# EAGLE design PCB_MOTEUR_V0_1b (EAGLE 9.2.2)
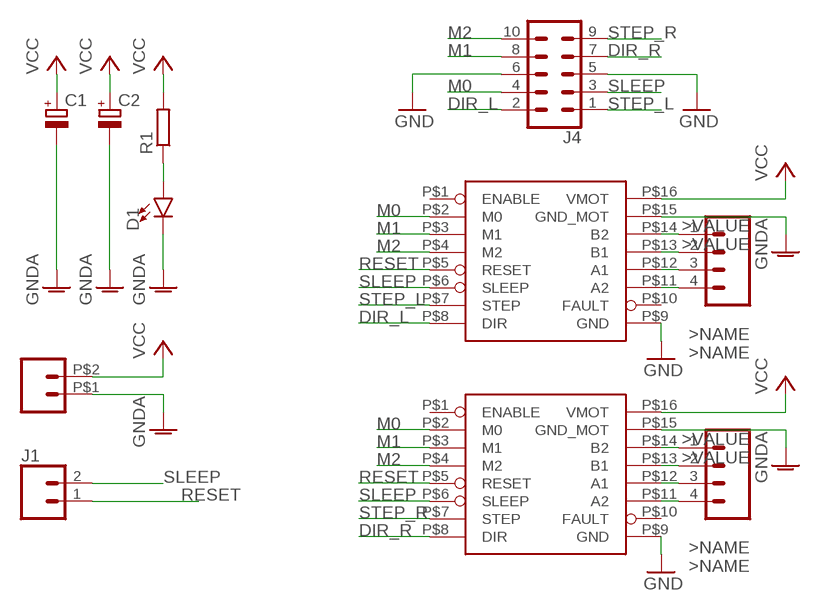
[diagram p0: schematic, sheet 1]

## Parts
C1  CPOL-EUE3.5-8  [E3,5-8]
C2  CPOL-EUE3.5-8  [E3,5-8]
D1  LED3MM  [LED_3MM]
J1  CONN_02  [1X02]
J2  CONN_027A-C  [NSK396-2C]
J3  CONN_04POLAR  [MOLEX-1X4]
J4  CONN_05X2SHD  [2X5-SHROUDED]
J5  CONN_04POLAR  [MOLEX-1X4]
R1  R-EU_0207/2V  [0207/2V]
U$1  DRV8825  [DRIVER_CARRIER_POLOLU_16]
U$2  DRV8825  [DRIVER_CARRIER_POLOLU_16]

## Nets
DIR_L: J4.2 U$1.P$8(DIR)
DIR_R: J4.7 U$2.P$8(DIR)
GND: J4.5 J4.6 U$1.P$9(GND) U$2.P$9(GND)
GNDA: C1.- C2.- D1.K(C) J2.P$1 U$1.P$15(GND_MOT) U$2.P$15(GND_MOT)
M0: J4.4 U$1.P$2(M0) U$2.P$2(M0)
M1: J4.8 U$1.P$3(M1) U$2.P$3(M1)
M2: J4.10 U$1.P$4(M2) U$2.P$4(M2)
N$1: J3.1 U$1.P$14(B2)
N$2: J3.2 U$1.P$13(B1)
N$3: J3.3 U$1.P$12(A1)
N$4: J3.4 U$1.P$11(A2)
N$5: D1.A R1.1
N$7: J5.1 U$2.P$14(B2)
N$8: J5.2 U$2.P$13(B1)
N$9: J5.3 U$2.P$12(A1)
N$14: J5.4 U$2.P$11(A2)
RESET: J1.1 U$1.P$5(RESET) U$2.P$5(RESET)
SLEEP: J1.2 J4.3 U$1.P$6(SLEEP) U$2.P$6(SLEEP)
STEP_L: J4.1 U$1.P$7(STEP)
STEP_R: J4.9 U$2.P$7(STEP)
VCC: C1.+ C2.+ J2.P$2 R1.2 U$1.P$16(VMOT) U$2.P$16(VMOT)
Unconnected: U$1.P$1(ENABLE) U$1.P$10(FAULT) U$2.P$1(ENABLE) U$2.P$10(FAULT)

## Library data of the parts
C1 C2 = rcl:CPOL-EU: POLARIZED CAPACITOR, European symbol; SPICEPREFIX: C
D1 = OPENBOT:LED: LED (Generic) Standard schematic elements and footprints for 5mm, 3mm, 1206, and 0603 sized LEDs. Generic LEDs with no color specified.; PROD_ID: DIO-08794
J1 J2 = OPENBOT:CONN_02: Multi connection point. Often used as Generic Header-pin footprint for 0.1 inch spaced/style header connections On any of the 0.1 inch spaced packages, you can populate with these: Break Away Headers - Straight <https://www.sparkfun.com/products/116> (PRT-00116) Break Away Male Headers - Right Angle <https://www.sparkfun.com/products/553> (PRT-00553) Female Headers <https://www.sparkfun.com/products/115> (PRT-00115) Break Away Headers - Machine Pin <https://www.sparkfun.com/products/117> (PRT-00117) Break Away Female Headers - Swiss Machine Pin <https://www.sparkfun.com/products/743> (PRT-00743) For SCREWTERMINALS and SPRING TERMINALS visit here: Screw Terimnals on SparkFun.com <https://www.sparkfun.com/search/results?term=Screw+Terminals> (5mm/3.5mm/2.54mm spacing) This device is also useful as a general connection point to wire up your design to another part of your project. Our various solder wires solder well into these plated through hole pads. Hook-Up Wire - Assortment (Stranded, 22 AWG) <https://www.sparkfun.com/products/11375> (PRT-11375) Hook-Up Wire - Assortment (Solid Core, 22 AWG) <https://www.sparkfun.com/products/11367> (PRT-11367) View the entire wire category on our website here <https://www.sparkfun.com/categories/141> Special notes: Molex polarized connector foot print use with: PRT-08233 with associated crimp pins and housings. 2.54_SCREWTERM for use with PRT-10571. 3.5mm Screw Terminal footprints for PRT-08084 5mm Screw Terminal footprints for use with PRT-08432 Multi connection point. Often used as Generic Header-pin footprint for 0.1 inch spaced/style header connections On any of the 0.1 inch spaced packages, you can populate with these: Break Away Headers - Straight <https://www.sparkfun.com/products/116> (PRT-00116) Break Away Male Headers - Right Angle <https://www.sparkfun.com/products/553> (PRT-00553) Female Headers <https://www.sparkfun.com/products/115> (PRT-00115) Break Away Headers - Machine Pin <https://www.sparkfun.com/products/117> (PRT-00117) Break Away Female Headers - Swiss Machine Pin <https://www.sparkfun.com/products/743> (PRT-00743) For SCREWTERMINALS and SPRING TERMINALS visit here: Screw Terimnals on SparkFun.com <https://www.sparkfun.com/search/results?term=Screw+Terminals> (5mm/3.5mm/2.54mm spacing) This device is also useful as a general connection point to wire up your design to another part of your project. Our various solder wires solder well into these plated through hole pads. Hook-Up Wire - Assortment (Stranded, 22 AWG) <https://www.sparkfun.com/products/11375> (PRT-11375) Hook-Up Wire - Assortment (Solid Core, 22 AWG) <https://www.sparkfun.com/products/11367> (PRT-11367) View the entire wire category on our website here <https://www.sparkfun.com/categories/141> Special notes: Molex polarized connector foot print use with: PRT-08233 with associated crimp pins and housings. 2.54_SCREWTERM for use with PRT-10571. 3.5mm Screw Terminal footprints for PRT-08084 5mm Screw Terminal footprints for use with PRT-08432
J3 J5 = OPENBOT:CONN_04: Multi connection point. Often used as Generic Header-pin footprint for 0.1 inch spaced/style header connections On any of the 0.1 inch spaced packages, you can populate with these: Break Away Headers - Straight <https://www.sparkfun.com/products/116> (PRT-00116) Break Away Male Headers - Right Angle <https://www.sparkfun.com/products/553> (PRT-00553) Female Headers <https://www.sparkfun.com/products/115> (PRT-00115) Break Away Headers - Machine Pin <https://www.sparkfun.com/products/117> (PRT-00117) Break Away Female Headers - Swiss Machine Pin <https://www.sparkfun.com/products/743> (PRT-00743) For SCREWTERMINALS and SPRING TERMINALS visit here: Screw Terimnals on SparkFun.com <https://www.sparkfun.com/search/results?term=Screw+Terminals> (5mm/3.5mm/2.54mm spacing) This device is also useful as a general connection point to wire up your design to another part of your project. Our various solder wires solder well into these plated through hole pads. Hook-Up Wire - Assortment (Stranded, 22 AWG) <https://www.sparkfun.com/products/11375> (PRT-11375) Hook-Up Wire - Assortment (Solid Core, 22 AWG) <https://www.sparkfun.com/products/11367> (PRT-11367) View the entire wire category on our website here <https://www.sparkfun.com/categories/141> Special notes: Molex polarized connector foot print use with SKU : PRT-08231 with associated crimp pins and housings. 1MM SMD Version SKU: PRT-10208 Multi connection point. Often used as Generic Header-pin footprint for 0.1 inch spaced/style header connections On any of the 0.1 inch spaced packages, you can populate with these: Break Away Headers - Straight <https://www.sparkfun.com/products/116> (PRT-00116) Break Away Male Headers - Right Angle <https://www.sparkfun.com/products/553> (PRT-00553) Female Headers <https://www.sparkfun.com/products/115> (PRT-00115) Break Away Headers - Machine Pin <https://www.sparkfun.com/products/117> (PRT-00117) Break Away Female Headers - Swiss Machine Pin <https://www.sparkfun.com/products/743> (PRT-00743) For SCREWTERMINALS and SPRING TERMINALS visit here: Screw Terimnals on SparkFun.com <https://www.sparkfun.com/search/results?term=Screw+Terminals> (5mm/3.5mm/2.54mm spacing) This device is also useful as a general connection point to wire up your design to another part of your project. Our various solder wires solder well into these plated through hole pads. Hook-Up Wire - Assortment (Stranded, 22 AWG) <https://www.sparkfun.com/products/11375> (PRT-11375) Hook-Up Wire - Assortment (Solid Core, 22 AWG) <https://www.sparkfun.com/products/11367> (PRT-11367) View the entire wire category on our website here <https://www.sparkfun.com/categories/141> Special notes: Molex polarized connector foot print use with SKU : PRT-08231 with associated crimp pins and housings. 1MM SMD Version SKU: PRT-10208; PROD_ID: CONN-08186; SF_ID: PRT-08231
J4 = OPENBOT:CONN_05X2: Multi connection point. Often used as Generic Header-pin footprint for 0.1 inch spaced/style header connections For AVR SPI programming port, see special device with nice symbol: "AVR_SPI_PROG_5x2.dev" You can populate with any combo of single row headers, but if you'd like an exact match, check these: 2x5 AVR ICSP Male Header <https://www.sparkfun.com/products/778> (PRT-00778) 2x5 Pin Shrouded Header <https://www.sparkfun.com/products/8506> (PRT-08506) On any of the 0.1 inch spaced packages, you can populate with these: Break Away Headers - Straight <https://www.sparkfun.com/products/116> (PRT-00116) Break Away Male Headers - Right Angle <https://www.sparkfun.com/products/553> (PRT-00553) Female Headers <https://www.sparkfun.com/products/115> (PRT-00115) Break Away Headers - Machine Pin <https://www.sparkfun.com/products/117> (PRT-00117) Break Away Female Headers - Swiss Machine Pin <https://www.sparkfun.com/products/743> (PRT-00743) Special note: the shrouded connector mates well with our 5x2 ribbon cables: 2x5 Pin IDC Ribbon Cable <https://www.sparkfun.com/products/8535> (PRT-08535); PROD_ID: CONN-08671; SF_ID: PRT-08506
R1 = rcl:R-EU_: RESISTOR, European symbol; SPICEPREFIX: R
U$1 U$2 = KARIBOUS:DRV8825

## Board
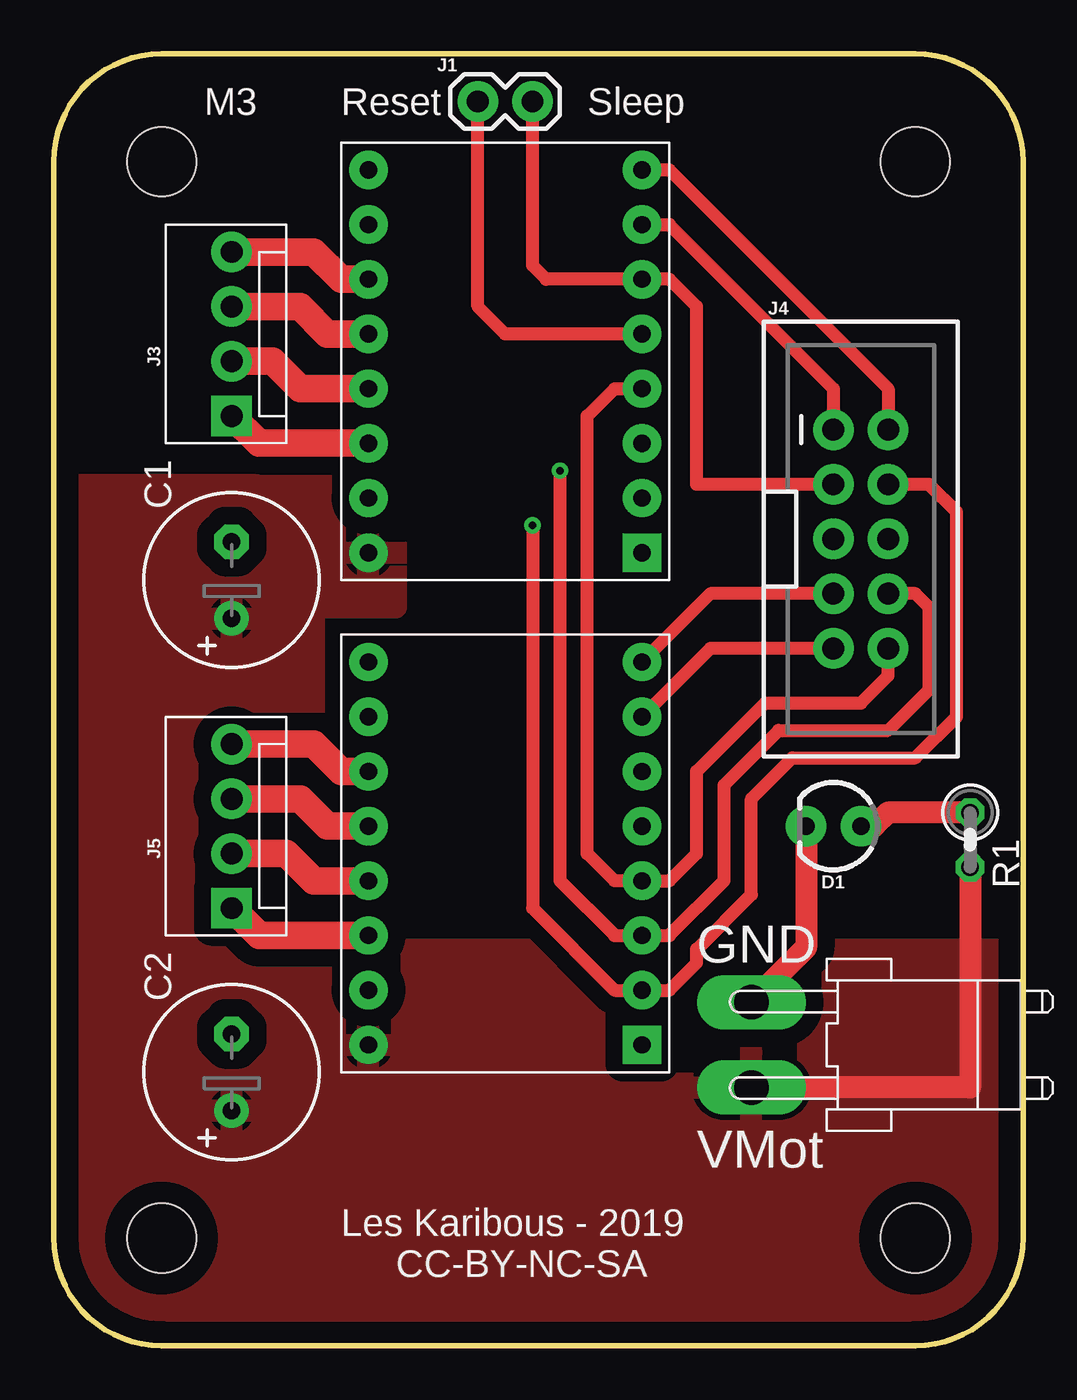
[diagram p1: board, top side]
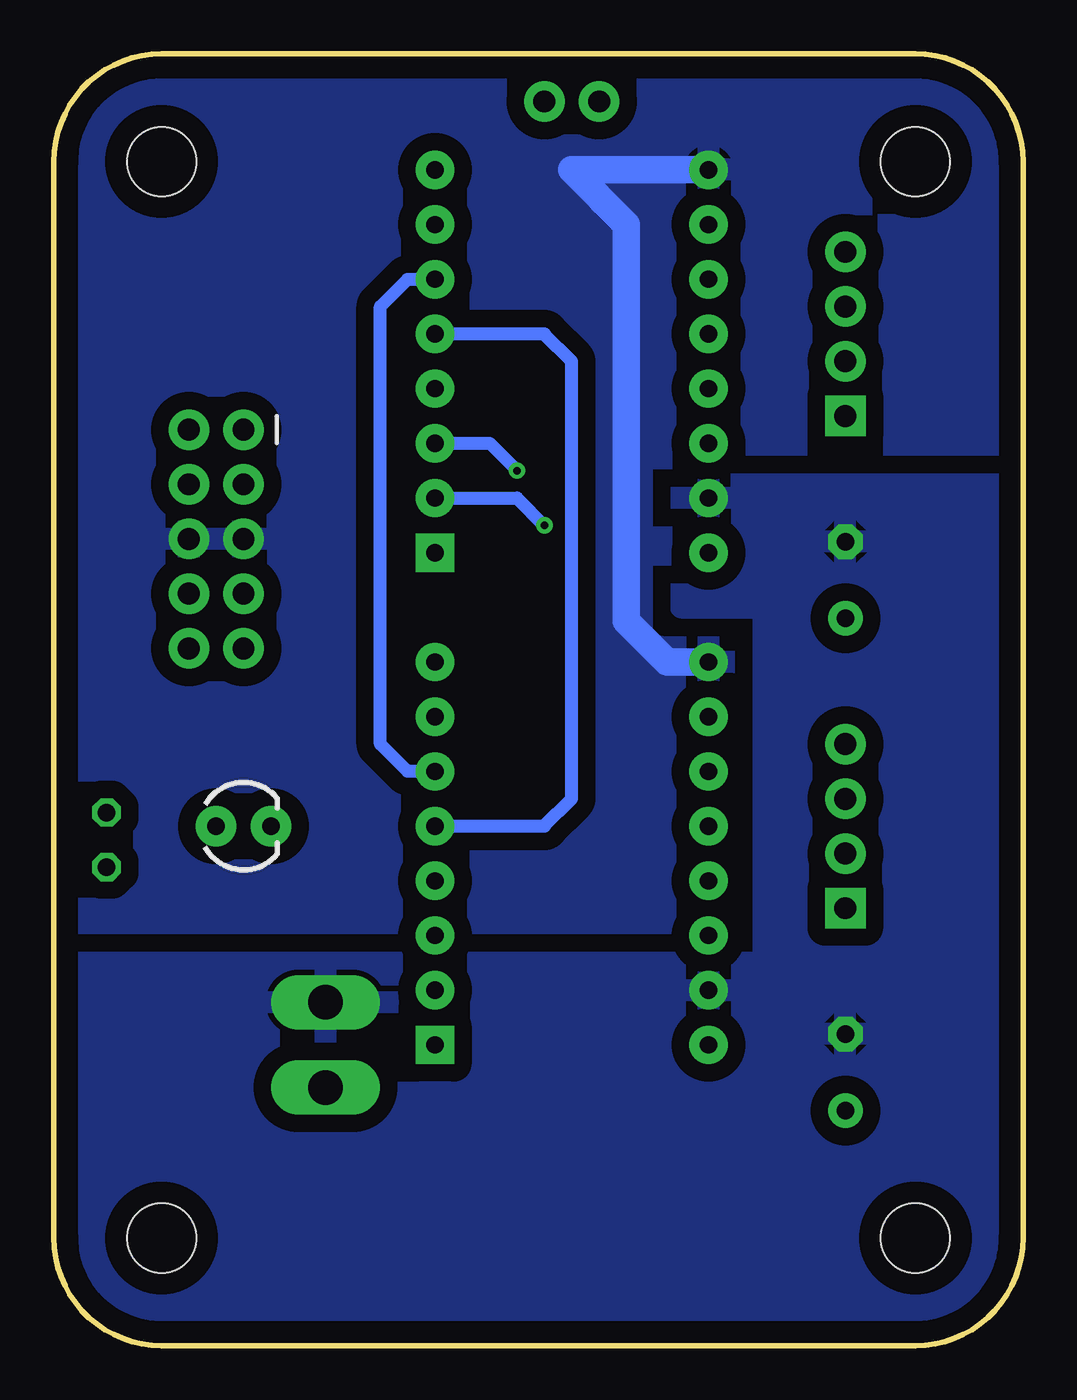
[diagram p2: board, bottom side, seen from below]

Size 45 x 60 mm. Coordinates in mm from the lower left corner, seen from the top.
Outline: 40,0 arc90 45,5 45,55 arc90 40,60 5,60 arc90 0,55 0,5 arc90 5,0 40,0
Copper layers (1*16): Top 0.035mm / dielectric 1.5mm / Bottom 0.035mm
Design rules "default": minimum track width 6mil, minimum drill 0.35mm, track to track 6mil, track to pad 6mil, pad to pad 6mil, via to via 6mil, smd to smd 6mil, copper to edge 40mil, drill to drill 6mil, minimum pad ring 10mil, minimum via ring 8mil, stop-mask expansion 4mil, vias tented up to drill 0mil, thermal gap 10mil
Holes 3.2 mm at 40,5 5,55 5,5 40,55

### Footprints (pad centres in the part's own frame; a part is rotated, then mirrored left to right if it is on the bottom)
E3,5-8 = drill 0.813 pad 1.6: + -1.778,0 | drill 0.813 pad 1.6 octagon: - 1.778,0
LED_3MM = drill 0.813 pad 1.88: A -1.27,0; K 1.27,0
1X02 = drill 1.016 pad 1.88: 1 0,0; 2 2.54,0
NSK396-2C = drill 1.6 pad 2.54 long: P$1 -1.98,0; P$2 1.98,0
MOLEX-1X4 = drill 1.016 pad 1.88 square: 1 0,0 | drill 1.016 pad 1.88: 2 2.54,0; 3 5.08,0; 4 7.62,0
2X5-SHROUDED = drill 1.016 pad 1.88: 1 -1.27,5.08; 2 1.27,5.08; 3 -1.27,2.54; 4 1.27,2.54; 5 -1.27,0; 6 1.27,0; 7 -1.27,-2.54; 8 1.27,-2.54; 9 -1.27,-5.08; 10 1.27,-5.08
0207/2V = drill 0.813 octagon: 1 -1.27,0; 2 1.27,0
DRIVER_CARRIER_POLOLU_16 = drill 0.8 pad 1.778 square: P$1 0,0 | drill 0.8 pad 1.778: P$2 0,-2.54; P$3 0,-5.08; P$4 0,-7.62; P$5 0,-10.16; P$6 0,-12.7; P$7 0,-15.24; P$8 0,-17.78; P$9 12.7,-17.78; P$10 12.7,-15.24; P$11 12.7,-12.7; P$12 12.7,-10.16; P$13 12.7,-7.62; P$14 12.7,-5.08; P$15 12.7,-2.54; P$16 12.7,0

### Placement (x,y rotation side)
C1  8.26,35.56 90 top
C2  8.26,12.7 90 top
D1  36.2,24.13 180 top
J1  19.68,57.78 0 top
J2  32.38,13.97 270 top
J3  8.26,43.18 90 top
J4  37.47,37.47 0 top
J5  8.26,20.32 90 top
R1  42.55,23.5 270 top
U$1  27.3,36.83 180 top
U$2  27.3,13.97 180 top

### Tracks (layer width: path | path; a pad name or v marks a point on that pad's centre or on a via)
DIR_L
  Top 0.61: U$1.P$8 28.57,54.61 38.73,44.45 J4.2
DIR_R
  Top 0.61: J4.7 30.48,34.92 U$2.P$8
GND
  Bottom 1.27: U$2.P$9 16.51,31.75 18.41,33.66 18.41,52.07 20.95,54.61 U$1.P$9
  pour Bottom (isolate 0.813, rank 2): -0.64,-0.64 -0.64,60.33 45.09,60.33 45.09,-0.64
GNDA
  Top 1.016: D1.K 34.92,18.49 J2.P$1
  pour Bottom (isolate 0.813): -0.64,40.01 15.88,40.01 15.88,34.29 12.06,34.29 12.06,17.78 45.09,17.78 45.09,0 -0.64,0
M0  (via drill 0.35)
  Top 0.61: v22.23,38.1 22.23,20.32 26.04,16.51 U$2.P$2 | U$2.P$2 27.94,16.51 | U$2.P$2 28.57,16.51 29.84,17.78 29.84,18.41 32.38,20.95 32.38,25.4 34.29,27.3 40.01,27.3 41.91,29.21 41.91,38.73 40.64,40.01 J4.4
  Bottom 0.61: U$1.P$2 23.5,39.37 v22.23,38.1
M1  (via drill 0.35)
  Top 0.61: v23.5,40.64 23.5,21.59 26.04,19.05 U$2.P$3 | 27.94,19.05 U$2.P$3 | U$2.P$3 28.57,19.05 31.11,21.59 31.11,26.04 33.66,28.57 38.73,28.57 40.64,30.48 40.64,34.29 40.01,34.92 J4.8
  Bottom 0.61: U$1.P$3 24.77,41.91 v23.5,40.64
M2
  Top 0.61: U$1.P$4 26.04,44.45 24.77,43.18 24.77,22.86 26.04,21.59 U$2.P$4 28.57,21.59 29.84,22.86 29.84,26.67 33.02,29.84 37.47,29.84 38.73,31.11 J4.10
N$1
  Top 1.27: J3.1 9.53,41.91 U$1.P$14
N$2
  Top 1.27: J3.2 10.16,45.72 11.43,44.45 U$1.P$13
N$3
  Top 1.27: U$1.P$12 12.7,46.99 11.43,48.26 J3.3
N$4
  Top 1.27: U$1.P$11 13.34,49.53 12.06,50.8 J3.4
N$5
  Top 1.016: D1.A 38.1,24.13 38.73,24.77 R1.1
N$7
  Top 1.27: J5.1 9.53,19.05 U$2.P$14
N$8
  Top 1.27: U$2.P$13 12.06,21.59 10.79,22.86 J5.2
N$9
  Top 1.27: U$2.P$12 12.7,24.13 11.43,25.4 J5.3
N$14
  Top 1.27: U$2.P$11 13.34,26.67 12.06,27.94 J5.4
RESET
  Top 0.61: J1.1 19.68,48.26 20.95,46.99 U$1.P$5
  Bottom 0.61: U$2.P$5 22.23,24.13 20.95,25.4 20.95,45.72 22.23,46.99 U$1.P$5
SLEEP
  Top 0.61: J4.3 29.84,40.01 29.84,48.26 28.57,49.53 U$1.P$6 22.86,49.53 22.23,50.16 J1.2
  Bottom 0.61: U$2.P$6 28.57,26.67 29.84,27.94 29.84,48.26 28.57,49.53 U$1.P$6
STEP_L
  Top 0.61: U$1.P$7 28.57,52.07 36.2,44.45 J4.1
STEP_R
  Top 0.61: J4.9 30.48,32.38 U$2.P$7
VCC
  Top 1.016: R1.2 42.55,11.99 J2.P$2
  pour Top (isolate 0.813): -0.64,40.01 15.88,40.01 15.88,34.29 12.06,34.29 12.06,18.41 45.09,18.41 45.09,0 -0.64,0

### Text on the board
tNames: M3 | Reset | Sleep | GND | VMot | Les Karibous - 2019 | CC-BY-NC-SA